# EAGLE schematic template (EAGLE 9.4.2)

## Sheet 1 of 4
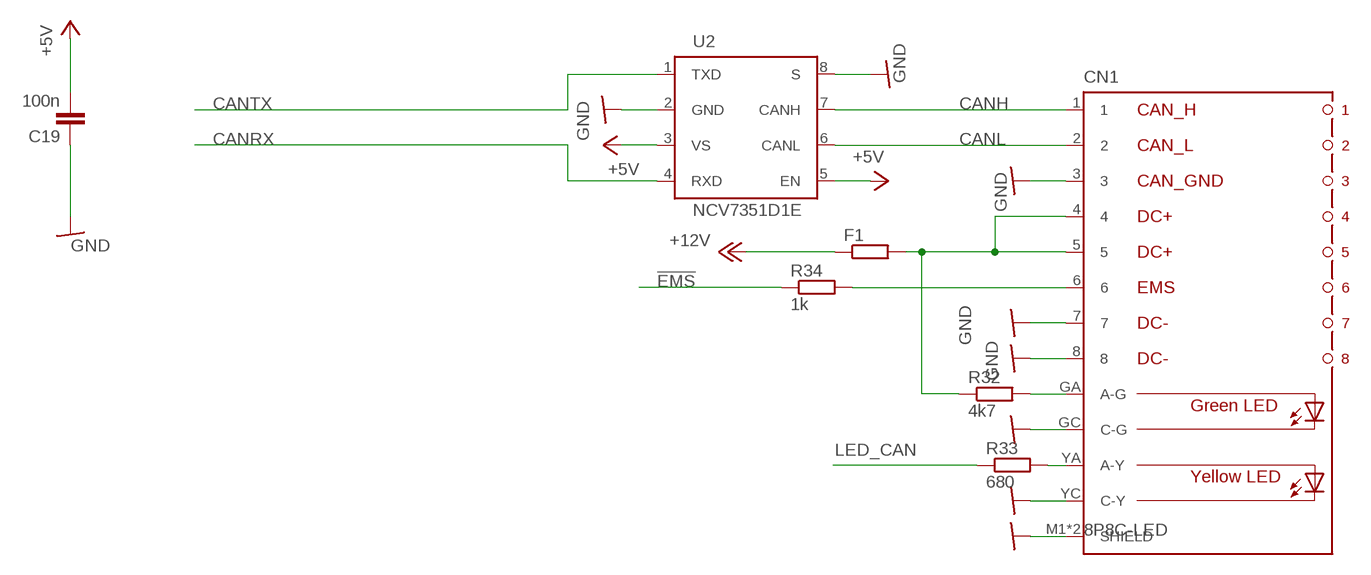
[diagram p0: schematic, sheet 1]

### Parts
C19  100n  C-EUC0603  [C0603]
CN1  8P8C-LED  [8P8C-LED]
F1  R-EU_R1206  [R1206]
R32  4k7  R-EU_R0603  [R0603]
R33  680  R-EU_R0603  [R0603]
R34  1k  R-EU_R0603  [R0603]
U2  NCV7351D1E  [SO08]

### Nets
!EMS: R34.1
!EMS_ISO: CN1.6 R34.2
+5V: C19.2 U2.3(VS) U2.5(EN) ; also sheet 2,3
+24V: F1.1 ; supply symbol labelled +12V
CANH: CN1.1 U2.7(CANH)
CANL: CN1.2 U2.6(CANL)
CANRX: U2.4(RXD) ; also sheet 2
CANTX: U2.1(TXD) ; also sheet 2
GND: C19.1 CN1.3 CN1.7 CN1.8 U2.2(GND) U2.8(S) ; supply symbol labelled GNDIO ; also sheet 2
GNDIO: CN1.GC(C-G) CN1.M1(SHIELD) CN1.M2(SHIELD) CN1.YC(C-Y) ; also sheet 3
LED_CAN: R33.1
N$6: CN1.GA(A-G) R32.2
N$12: CN1.YA(A-Y) R33.2
N$36: CN1.4 CN1.5 F1.2 R32.1

## Sheet 2 of 4
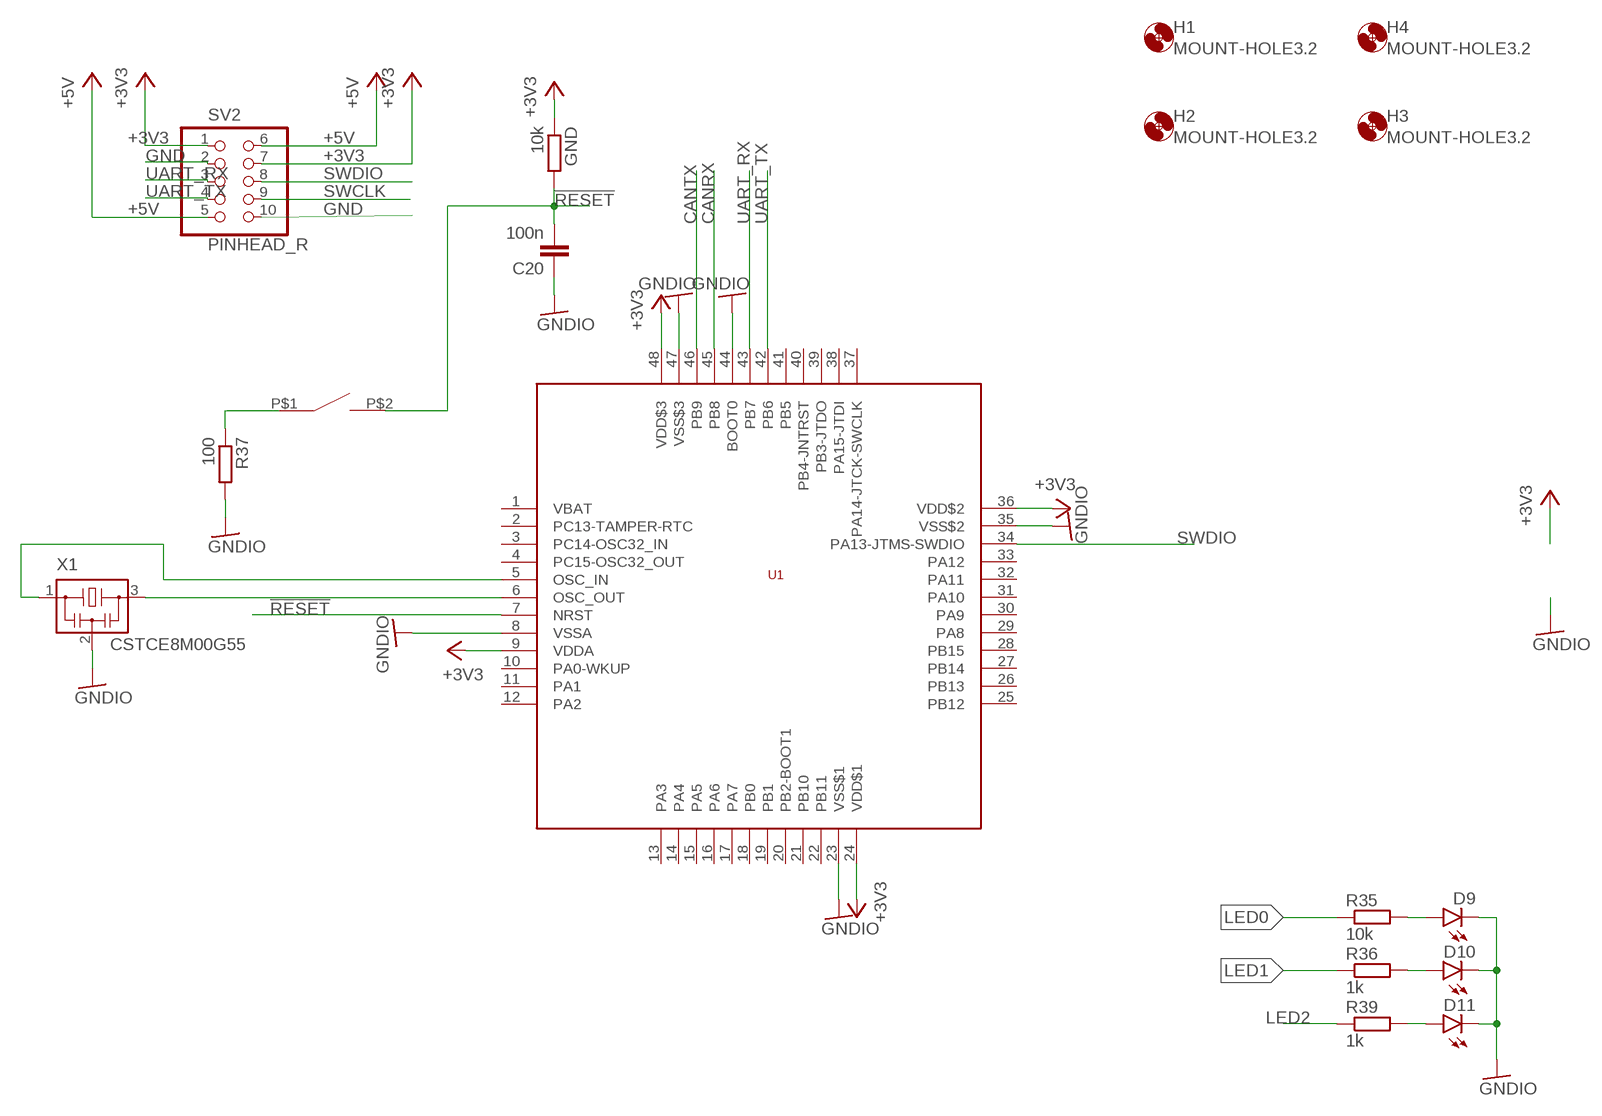
[diagram p1: schematic, sheet 2]

### Parts
C20  100n  C-EUC0603  [C0603]
D9  LEDCHIPLED_0805  [CHIPLED_0805]
D10  LEDCHIPLED_0805  [CHIPLED_0805]
D11  LEDCHIPLED_0805  [CHIPLED_0805]
GND  10k  R-EU_R0603  [R0603]
H1  MOUNT-HOLE3.2  [3,2]
H2  MOUNT-HOLE3.2  [3,2]
H3  MOUNT-HOLE3.2  [3,2]
H4  MOUNT-HOLE3.2  [3,2]
R35  10k  R-EU_R0603  [R0603]
R36  1k  R-EU_R0603  [R0603]
R37  100  R-EU_R0603  [R0603]
R39  1k  R-EU_R0603  [R0603]
SV2  PINHEAD_R  [PINHEDA_R]
SW1  SWITCH_TACTILETOP  [SWITCH_TACTILE_3X6]
U1  STM32F103C8  [LQFP48]
X1  CSTCE8M00G55  [CSTCE8M00G55]

### Nets
!RESET: C20.2 GND.2 SW1.P$2 U1.7(NRST)
+3V3: GND.1 SV2.1 SV2.7 U1.9(VDDA) U1.24(VDD$1) U1.36(VDD$2) U1.48(VDD$3) ; also sheet 3
+5V: SV2.5 SV2.6 ; also sheet 1,3
CANRX: U1.45(PB8) ; also sheet 1
CANTX: U1.46(PB9) ; also sheet 1
GND: C20.1 D9.C D10.C D11.C R37.2 SV2.2 SV2.10 U1.8(VSSA) U1.23(VSS$1) U1.35(VSS$2) U1.44(BOOT0) U1.47(VSS$3) X1.2 ; supply symbol labelled GNDIO ; also sheet 1
LED0: R35.1
LED1: R36.1
LED2: R39.1
N$37: D10.A R36.2
N$38: D9.A R35.2
N$39: U1.6(OSC_OUT) X1.3
N$40: U1.5(OSC_IN) X1.1
N$41: R37.1 SW1.P$1
N$44: D11.A R39.2
SWCLK: SV2.9
SWDIO: SV2.8 U1.34(PA13-JTMS-SWDIO)
UART_RX: SV2.3 U1.43(PB7)
UART_TX: SV2.4 U1.42(PB6)
Unconnected: U1.1(VBAT) U1.2(PC13-TAMPER-RTC) U1.3(PC14-OSC32_IN) U1.4(PC15-OSC32_OUT) U1.10(PA0-WKUP) U1.11(PA1) U1.12(PA2) U1.13(PA3) U1.14(PA4) U1.15(PA5) U1.16(PA6) U1.17(PA7) U1.18(PB0) U1.19(PB1) U1.20(PB2-BOOT1) U1.21(PB10) U1.22(PB11) U1.25(PB12) U1.26(PB13) U1.27(PB14) U1.28(PB15) U1.29(PA8) U1.30(PA9) U1.31(PA10) U1.32(PA11) U1.33(PA12) U1.37(PA14-JTCK-SWCLK) U1.38(PA15-JTDI) U1.39(PB3-JTDO) U1.40(PB4-JNTRST) U1.41(PB5)

## Sheet 3 of 4
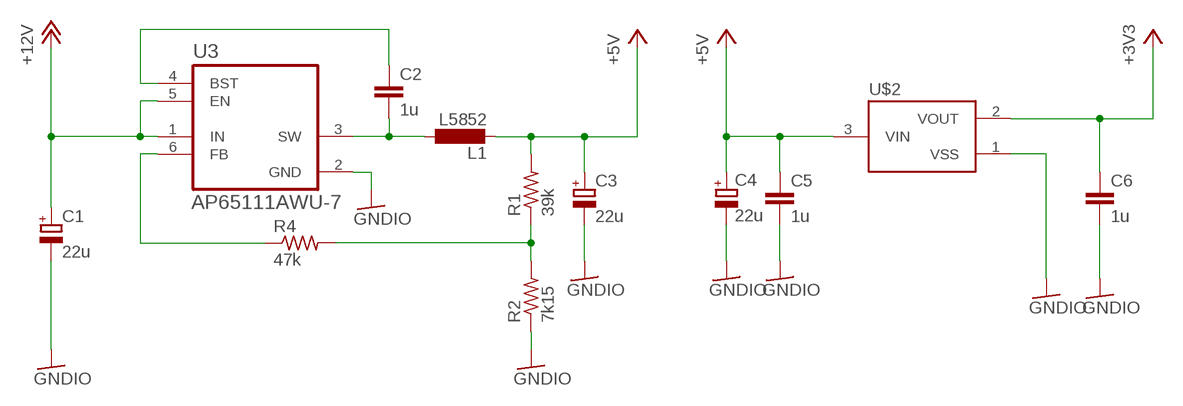
[diagram p2: schematic, sheet 3]

### Parts
C1  22u  CPOL-EUE2-5  [E2-5]
C2  1u  C-EUC0603  [C0603]
C3  22u  CPOL-EUE2-5  [E2-5]
C4  22u  CPOL-EUE3.5-8  [E3,5-8]
C5  1u  C-EUC0603  [C0603]
C6  1u  C-EUC0603  [C0603]
L1  L5852  [L5852]
R1  39k  R-US_R0603  [R0603]
R2  7k15  R-US_R0603  [R0603]
R4  47k  R-US_R0603  [R0603]
U3  AP65111AWU-7  [SOT95P280X100-6N]
U$2  AP2120  [SOT95P240X110-3]

### Nets
+3V3: C6.1 U$2.2(VOUT) ; also sheet 2
+5V: C3.+ C4.+ C5.1 L1.P$2 R1.2 U$2.3(VIN) ; also sheet 1,2
+12V: C1.+ U3.1(IN) U3.5(EN)
GNDIO: C1.- C3.- C4.- C5.2 C6.2 R2.1 U3.2(GND) U$2.1(VSS) ; also sheet 1
N$1: C2.2 L1.P$1 U3.3(SW)
N$2: C2.1 U3.4(BST)
N$3: R1.1 R2.2 R4.2
N$5: R4.1 U3.6(FB)

## Sheet 4 of 4

## Library data of the parts
C1 C3 C4 = rcl:CPOL-EU: POLARIZED CAPACITOR, European symbol; SPICEPREFIX: C
C2 C5 C6 = rcl:C-EU: CAPACITOR, European symbol; SPICEPREFIX: C
C19 C20 = rcl:C-EU: CAPACITOR, European symbol
CN1 = con-rj45:8P8C-LED: generic 8P8C connector with two LED's; OC_FARNELL: unknown; OC_NEWARK: unknown
D9-D11 = led:LED: LED OSRAM: - CHIPLED LG R971, LG N971, LY N971, LG Q971, LY Q971, LO R971, LY R971 LH N974, LH R974 LS Q976, LO Q976, LY Q976 LO Q996 - Hyper CHIPLED LW Q18S LB Q993, LB Q99A, LB R99A - SideLED LS A670, LO A670, LY A670, LG A670, LP A670 LB A673, LV A673, LT A673, LW A673 LH A674 LY A675 LS A676, LA A676, LO A676, LY A676, LW A676 LS A679, LY A679, LG A679 - Hyper Micro SIDELED® LS Y876, LA Y876, LO Y876, LY Y876 LT Y87S - SmartLED LW L88C, LW L88S LB L89C, LB L89S, LG L890 LS L89K, LO L89K, LY L89K LS L896, LA L896, LO L896, LY L896 - TOPLED LS T670, LO T670, LY T670, LG T670, LP T670 LSG T670, LSP T670, LSY T670, LOP T670, LYG T670 LG T671, LOG T671, LSG T671 LB T673, LV T673, LT T673, LW T673 LH T674 LS T676, LA T676, LO T676, LY T676, LB T676, LH T676, LSB T676, LW T676 LB T67C, LV T67C, LT T67C, LS T67K, LO T67K, LY T67K, LW E67C LS E67B, LA E67B, LO E67B, LY E67B, LB E67C, LV E67C, LT E67C LW T67C LS T679, LY T679, LG T679 LS T770, LO T770, LY T770, LG T770, LP T770 LB T773, LV T773, LT T773, LW T773 LH T774 LS E675, LA E675, LY E675, LS T675 LS T776, LA T776, LO T776, LY T776, LB T776 LHGB T686 LT T68C, LB T68C - Hyper Mini TOPLED® LB M676 - Mini TOPLED Santana® LG M470 LS M47K, LO M47K, LY M47K Source: http://www.osram.convergy.de LUXEON: - LUMILED® LXK2-PW12-R00, LXK2-PW12-S00, LXK2-PW14-U00, LXK2-PW14-V00 LXK2-PM12-R00, LXK2-PM12-S00, LXK2-PM14-U00 LXK2-PE12-Q00, LXK2-PE12-R00, LXK2-PE12-S00, LXK2-PE14-T00, LXK2-PE14-U00 LXK2-PB12-K00, LXK2-PB12-L00, LXK2-PB12-M00, LXK2-PB14-N00, LXK2-PB14-P00, LXK2-PB14-Q00 LXK2-PR12-L00, LXK2-PR12-M00, LXK2-PR14-Q00, LXK2-PR14-R00 LXK2-PD12-Q00, LXK2-PD12-R00, LXK2-PD12-S00 LXK2-PH12-R00, LXK2-PH12-S00 LXK2-PL12-P00, LXK2-PL12-Q00, LXK2-PL12-R00 Source: www.luxeon.com KINGBRIGHT: KA-3528ASYC Source: www.kingbright.com
F1 R32-R34 = rcl:R-EU_: RESISTOR, European symbol; SPICEPREFIX: R
GND R35-R37 R39 = rcl:R-EU_: RESISTOR, European symbol
H1-H4 = holes:MOUNT-HOLE: MOUNTING HOLE with drill center marker
L1 = l_ysk:L5852
R1 R2 R4 = rcl:R-US_: RESISTOR, American symbol; SPICEPREFIX: R
SV2 = LinSen:PINHEAD_R
SW1 = switch-tactile:SWITCH_TACTILE
U1 = stm32_mcu:STM32F103C8: STMicroelectronics STM32F103C8 Mainstream Performance line, ARM Cortex-M3 MCU with 64 Kbytes Flash, 72 MHz CPU, motor control, USB and CAN references: datasheet <https://www.st.com/resource/en/datasheet/stm32f103c8.pdf> product page <https://www.st.com/ja/microcontrollers/stm32f103c8.html>
U2 = on-semi:NCV7351D1E: High Speed CAN Transceiver Source: NCV7351-D.PDF <http://www.onsemi.com/PowerSolutions/document/NCV7351-D.PDF>
U3 = AP65111AWU-7:AP65111AWU-7: None; DESCRIPTION: Dcdc Conv Hv Buck Tsot26 t&r 3k; DIGI-KEY_PART_NUMBER: AP65111AWU-7DICT-ND; DIGI-KEY_PURCHASE_URL: https://www.digikey.jp/product-detail/en/diodes-incorporated/AP65111AWU-7/AP65111AWU-7DICT-ND/7652826?utm_source=snapeda&utm_medium=aggregator&utm_campaign=symbol; MF: Diodes Inc.; MP: AP65111AWU-7; PACKAGE: TSOT-23-6 Diodes Inc.
U$2 = torex:AP2120
X1 = resonator:CSTCE8M00G55